# EAGLE design June (EAGLE 9.0.1)
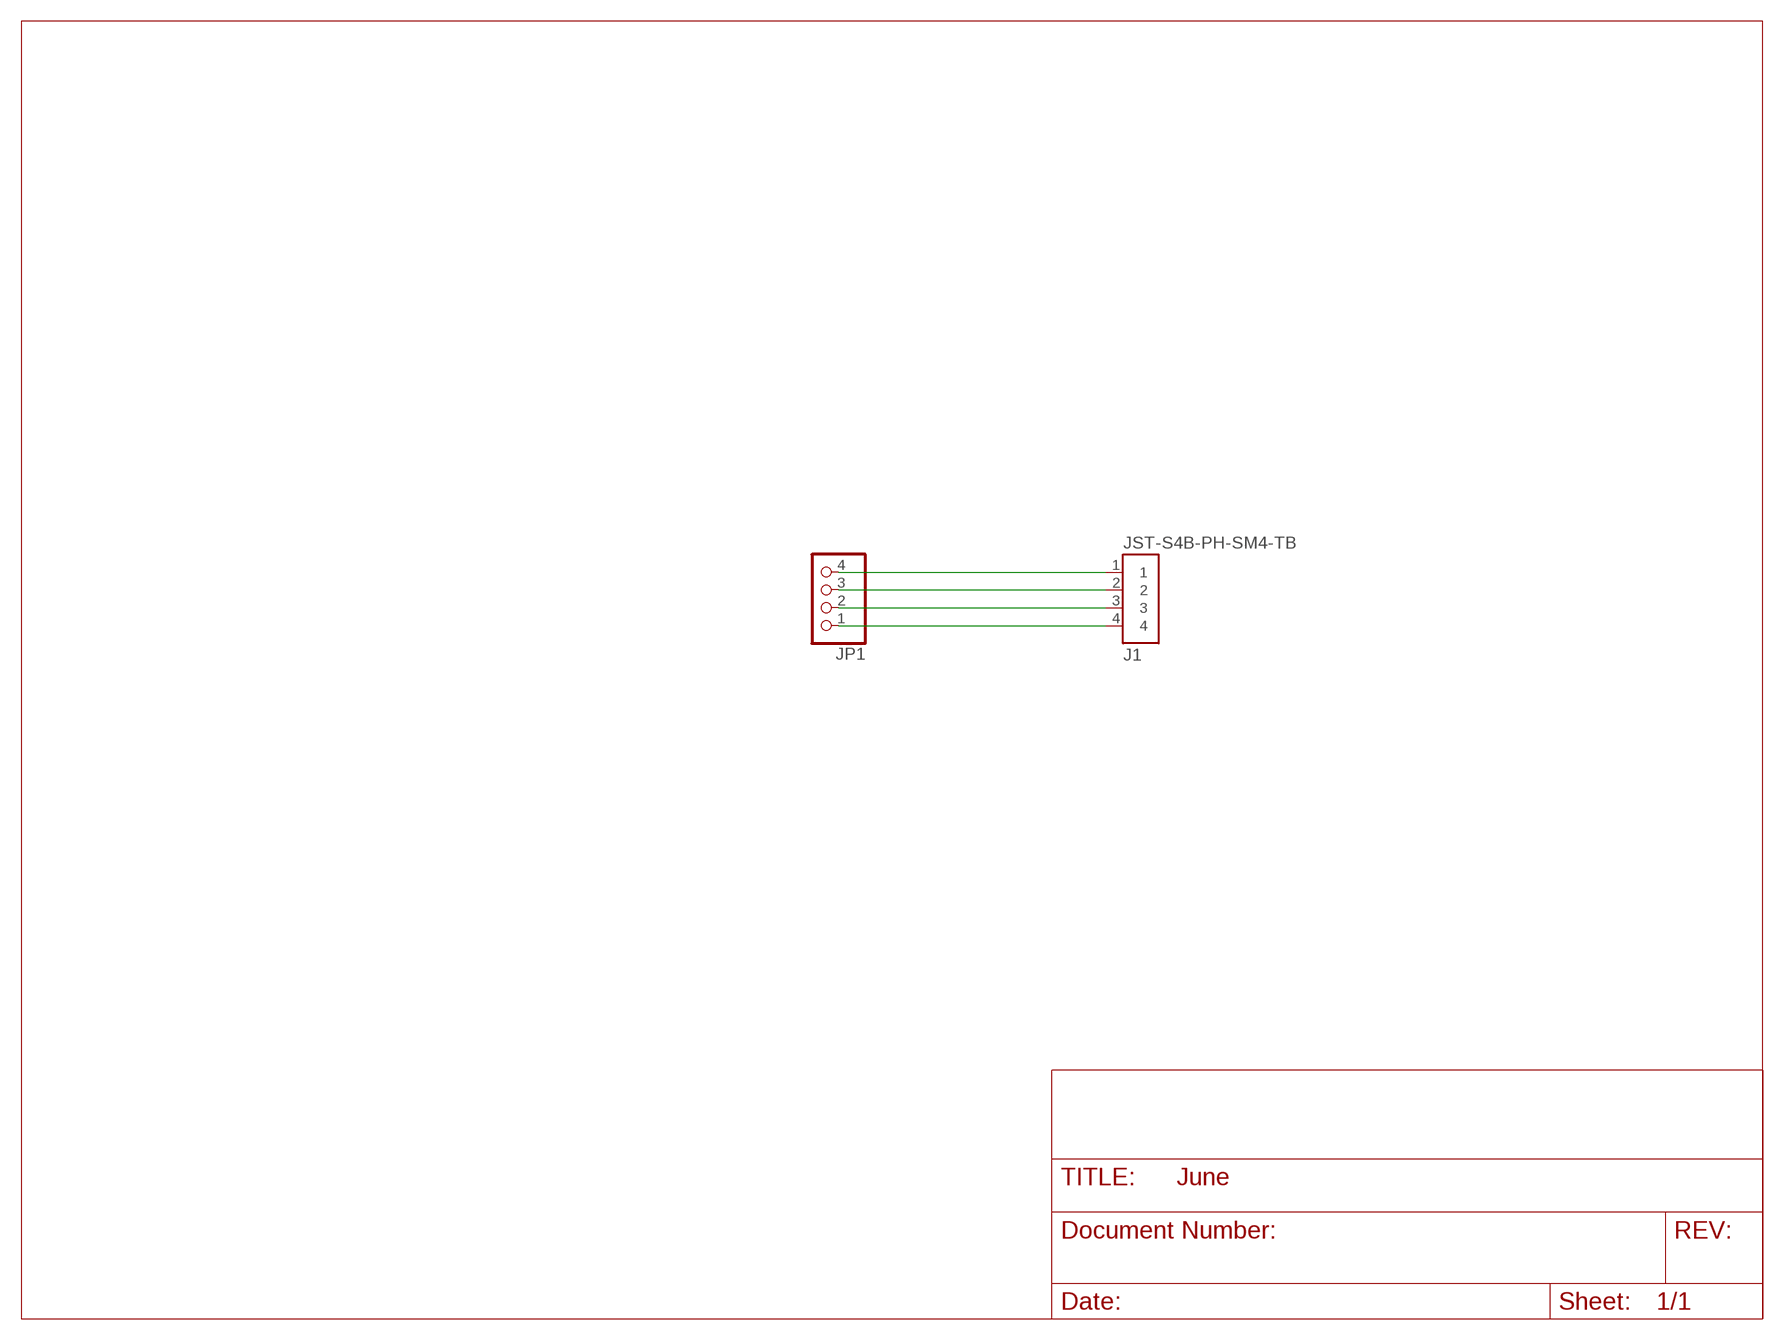
[diagram p0: schematic, sheet 1]

## Parts
J1  JST-S4B-PH-SM4-TB  [JST-S4B-PH-SM4-TB]
JP1  PINHD-1X4  [1X04]

## Nets
N$1: J1.1 JP1.4
N$2: J1.2 JP1.3
N$3: J1.3 JP1.2
N$4: J1.4 JP1.1

## Library data of the parts
J1 = Ooo-Connectors:JST-S4B-PH-SM4-TB
JP1 = pinhead:PINHD-1X4: PIN HEADER

## Board
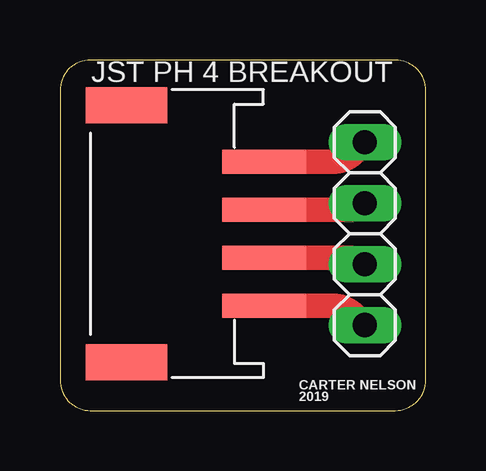
[diagram p1: board, top side]
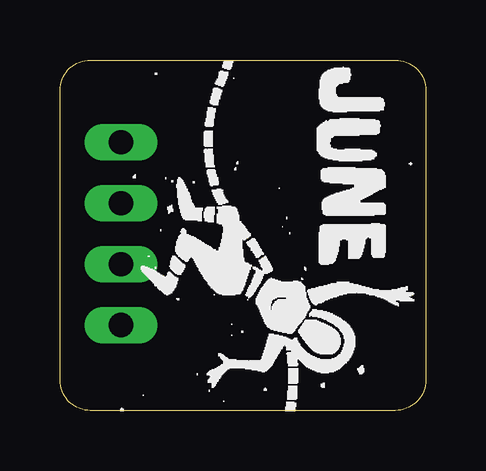
[diagram p2: board, bottom side, seen from below]

Size 15.24 x 14.61 mm. Coordinates in mm from the lower left corner, seen from the top.
Outline: 0,13.34 0,1.27 arc90 1.27,0 13.97,0 arc90 15.24,1.27 15.24,13.34 arc90 13.97,14.61 1.27,14.61 arc90 0,13.34
Copper layers (1*16): Top 0.035mm / dielectric 1.5mm / Bottom 0.035mm
Design rules "default": minimum track width 6mil, minimum drill 0.35mm, track to track 6mil, track to pad 6mil, pad to pad 6mil, via to via 6mil, smd to smd 6mil, copper to edge 40mil, drill to drill 6mil, minimum pad ring 10mil, minimum via ring 8mil, stop-mask expansion 4mil, vias tented up to drill 0mil, thermal gap 10mil

### Footprints (pad centres in the part's own frame; a part is rotated, then mirrored left to right if it is on the bottom)
JST-S4B-PH-SM4-TB = smd 3.5 x 1: 1 -7.25,3; 2 -7.25,1; 3 -7.25,-1; 4 -7.25,-3 | smd 3.4 x 1.5: 5 -1.5,5.35; 6 -1.5,-5.35
1X04 = drill 1.016 long: 1 -3.81,0; 2 -1.27,0; 3 1.27,0; 4 3.81,0

### Placement (x,y rotation side)
J1  1.27,7.37 180 top
JP1  12.7,7.37 270 top

### Tracks (layer width: path | path; a pad name or v marks a point on that pad's centre or on a via)
N$1
  Top 1.016: J1.1 11.36,4.37 arc-45 12.26,3.99 JP1.4
N$2
  Top 1.016: J1.2 12.05,6.37 arc-45 JP1.3
N$3
  Top 1.016: J1.3 12.05,8.37 arc45 JP1.2
N$4
  Top 1.016: J1.4 11.36,10.37 arc45 12.26,10.74 JP1.1

### Text on the board
tPlace: JST PH 4 BREAKOUT | CARTER NELSON / 2019